# Altium schematic sheet BMS_PowerRegulation.SchDoc
size 431 x 279 mm; SheetNumber: 3; SheetTotal: 5
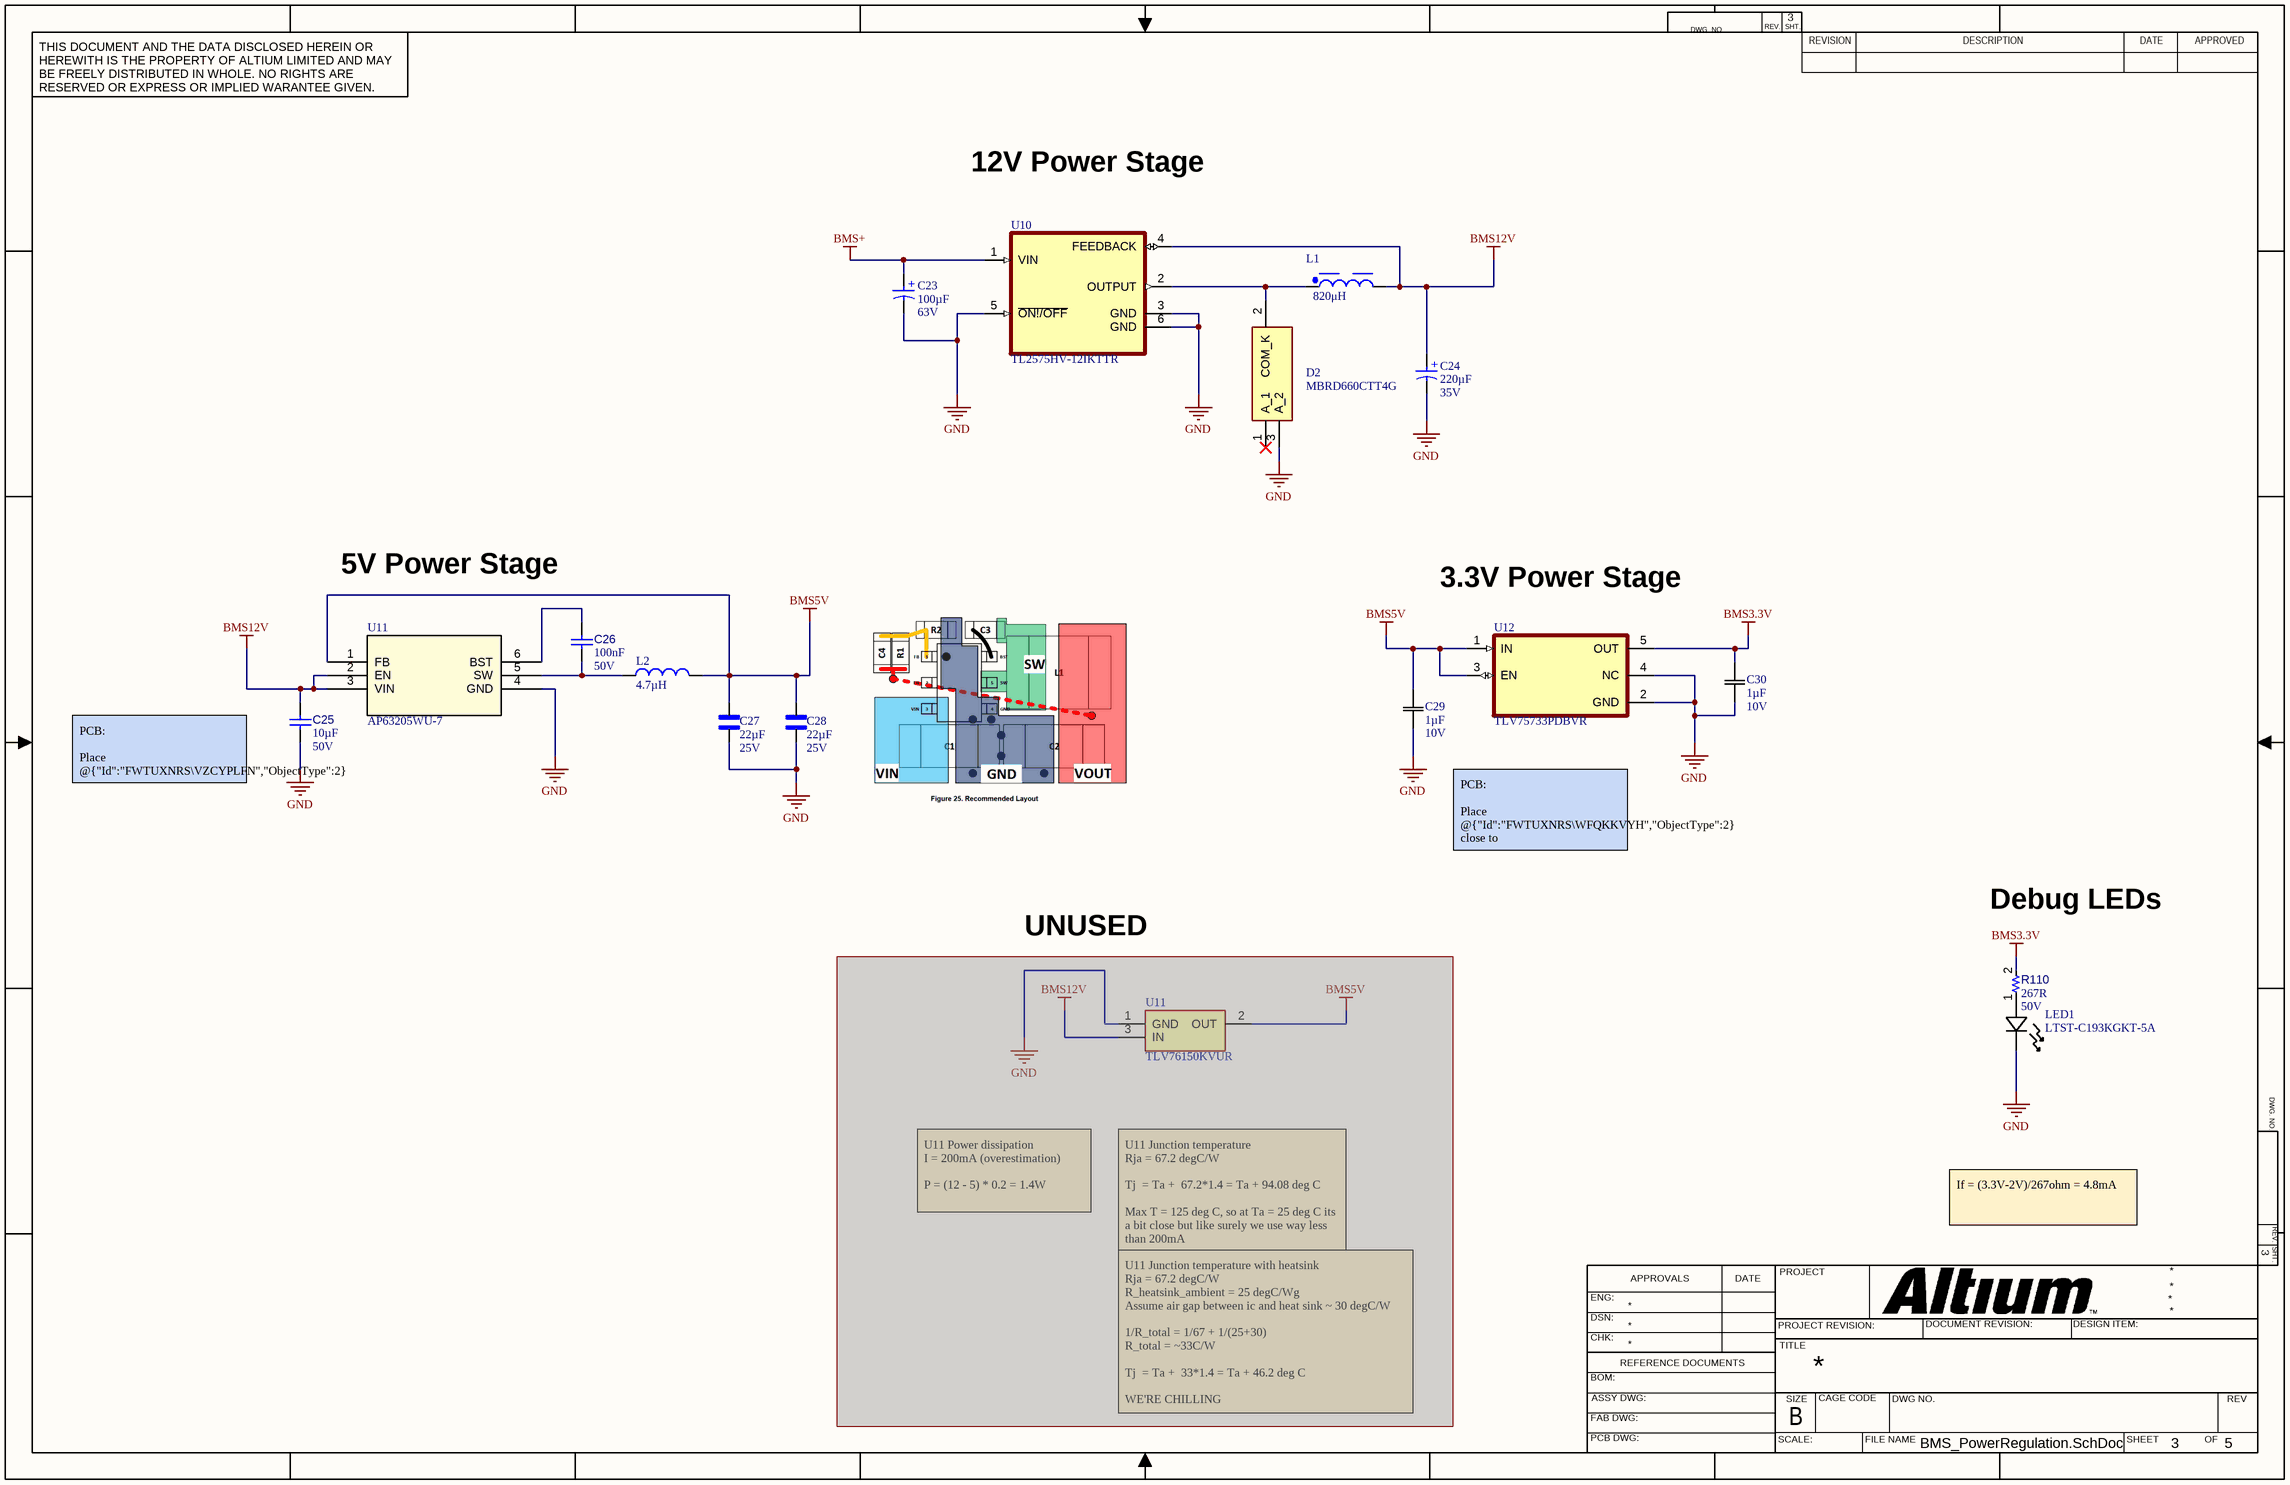
[diagram p0: BMS_PowerRegulation.SchDoc]

## Parts
(Parts that share a designator on the sheet are numbered #1, #2 ... from top to bottom, then left to right.)
C23  value 100µF  Rated Voltage (DC): 63V  [WCAP-ASLI_D10H10.5]  (hidden comment: 865080757014)
C24  value 220µF  Rated Voltage (DC): 35V  [WCAP-ASLI_D8H10.5]  (hidden comment: 865080553014)
C25  value 10µF  Voltage Rating: 50V  [CAPC0805(2012)145_L]  (hidden comment: Samsung Electro-Mechanics CL21A106KBYQNNE)
C26  value 100nF  Voltage Rating: 50V  [CAPC0402(1005)60_L]  (hidden comment: Capacitor 100nF +/-20% 50V 0402)
C27  value 22µF  Voltage Rating: 25V  [CAPC2012X145N]  (hidden comment: CL21A226MAYNNNE)
C28  value 22µF  Voltage Rating: 25V  [CAPC2012X145N]  (hidden comment: CL21A226MAYNNNE)
C29  value 1µF  Voltage Rating: 10V  [CAP_CL10_SAM]  (hidden comment: CL10B105KP8NNNC)
C30  value 1µF  Voltage Rating: 10V  [CAP_CL10_SAM]  (hidden comment: CL10B105KP8NNNC)
D2  MBRD660CTT4G  [MBRD660CTT4G]
L1  Inductance: 820μH  [WE-PD_1210]  (hidden comment: 7447709821 820uH)
L2  value 4.7µH  [INDC2520X100N]  (hidden comment: LQM2HPN4R7MG0L)
LED1  LTST-C193KGKT-5A  [LED_LTST-C194K-0603_1P6X0P8X0P3_LTO]
R110  value 267R  Voltage Rating: 50V  [RESC0402(1005)_L]  (hidden comment: RT0402BRD07267RL)
U10  TL2575HV-12IKTTR  [VREG_TPS79625KTTR]
U11#1  AP63205WU-7  [SOIC_05WU-7_DIO]
U11#2  TLV76150KVUR  [TLV76150KVUR_WithHeatsink]  (masked out: inside a compile mask, not in the netlist)
U12  TLV75733PDBVR  [SOT95P280X145-5N]

## Nets
BMS3.3V: C30.2 R110.2 U12.5(OUT)
BMS5V: C27.2 C28.2 C29.2 L2.2 U11#1.1(FB) U12.1(IN) U12.3(EN)
BMS12V: C24.1(P) C25.1 L1.2 U10.4(FEEDBACK) U11#1.2(EN) U11#1.3(VIN)
BMS+: C23.1(P) U10.1(VIN)
GND: C23.2(N) C24.2(N) C25.2 C27.1 C28.1 C29.1 C30.1 D2.3(A_2) LED1.1 U10.3(GND) U10.5(~{ON!/OFF}) U10.6(GND) U11#1.4(GND) U12.2(GND) U12.4(NC)
NetC26_1: C26.1 L2.1 U11#1.5(SW)
NetC26_2: C26.2 U11#1.6(BST)
NetD2_2: D2.2(COM_K) L1.1 U10.2(OUTPUT)
NetLED1_2: LED1.2 R110.1

Not connected (* = marked no-connect by the designer): D2 1(A_1)*

## Notes on the sheet
- 12V Power Stage
- 5V Power Stage
- 3.3V Power Stage
- PCB:
  Place @{"Id":"FWTUXNRS\VZCYPLFN","ObjectType":2} close to @{"Id":"FWTUXNRS\CUETEAYZ","ObjectType":2} pin 3
- PCB:
  Place @{"Id":"FWTUXNRS\WFQKKVYH","ObjectType":2} close to @{"Id":"FWTUXNRS\HPDKJLBX","ObjectType":2} pin 1
  Place @{"Id":"FWTUXNRS\TOYSBIWG","ObjectType":2} close to @{"Id":"FWTUXNRS\HPDKJLBX","ObjectType":2} pin 5
- UNUSED
- Debug LEDs
- U11 Power dissipation
  I = 200mA (overestimation)
  P = (12 - 5) * 0.2 = 1.4W
- If = (3.3V-2V)/267ohm = 4.8mA
- U11 Junction temperature
  Rja = 67.2 degC/W
  Tj  = Ta +  67.2*1.4 = Ta + 94.08 deg C
  Max T = 125 deg C, so at Ta = 25 deg C its a bit close but like surely we use way less than 200mA
- U11 Junction temperature with heatsink
  Rja = 67.2 degC/W
  R_heatsink_ambient = 25 degC/Wg
  Assume air gap between ic and heat sink ~ 30 degC/W
  1/R_total = 1/67 + 1/(25+30)
  R_total = ~33C/W
  Tj  = Ta +  33*1.4 = Ta + 46.2 deg C
  WE'RE CHILLING
- DWG. NO.
- REV.
- SHT.
- THIS DOCUMENT AND THE DATA DISCLOSED HEREIN OR HEREWITH IS THE PROPERTY OF ALTIUM LIMITED AND MAY BE FREELY DISTRIBUTED IN WHOLE. NO RIGHTS ARE RESERVED OR EXPRESS OR IMPLIED WARANTEE GIVEN.
- REVISION
- DESCRIPTION
- DATE
- APPROVED
- ENG:
- APPROVALS
- PROJECT
- DSN:
- CHK:
- REFERENCE DOCUMENTS
- PROJECT REVISION:
- TITLE
- DOCUMENT REVISION:
- DESIGN ITEM:
- BOM:
- FAB DWG:
- PCB DWG:
- ASSY DWG:
- SCALE:
- SIZE
- B
- CAGE CODE
- FILE NAME
- DWG NO.
- SHEET
- OF
- REV
- (in symbol CMP-001-00090-1) +
- (in symbol CMP-001-00091-1) +

## Library data of the parts
C23 = CMP-001-00091-1: WCAP-ASLI Aluminum Electrolytic Capacitor, V-Chip, D10 x H10.5mm, 100uF, 63V; Manufacturer: Wurth Elektronik; Technical Reference: ASEF105101M063DVCTEB000; Dissipation Factor: 12%; Leakage Current: 63uA; Ripple Current: 280mA; Endurance: 2000h; Capacitance Tolerance: +/-20%; ComponentLink2URL: https://www.we-online.com/redexpert/spec/865080757014?ad; Diameter: 10mm; ComponentLink2Description: Datasheet Link; Source: WCAP-ASLI.SchLib; Match Code: WCAP-ASLI; Manufacturer Part Number: 865080757014; Mount: Surface Mount; ComponentLink1URL: https://www.we-online.com/redexpert/article/865080757014?ad; Operating Temperature Max: 105°C; Design Item ID: 865080757014; Height: 10.5mm; Operating Temperature Min: -55°C; Packaging: Tape and Reel; Category: Aluminum Electrolytic Capacitors; ComponentLink1Description: Website Link
C24 = CMP-001-00090-1: WCAP-ASLI Aluminum Electrolytic Capacitor, V-Chip, D8 x H10.5mm, 220uF, 35V; Manufacturer: Wurth Elektronik; Ripple Current: 570mA; Endurance: 2000h; Dissipation Factor: 14%; Technical Reference: ASEE105221M035DVCTEB000; Capacitance Tolerance: +/-20%; Leakage Current: 77uA; Packaging: Tape and Reel; Category: Aluminum Electrolytic Capacitors; ComponentLink1URL: https://www.we-online.com/redexpert/article/865080553014?ad; Diameter: 8mm; ComponentLink2URL: https://www.we-online.com/redexpert/spec/865080553014?ad; Height: 10.5mm; Source: WCAP-ASLI.SchLib; Operating Temperature Min: -55°C; Operating Temperature Max: 105°C; Design Item ID: 865080553014; ComponentLink2Description: Datasheet Link; Match Code: WCAP-ASLI; Mount: Surface Mount; Manufacturer Part Number: 865080553014; ComponentLink1Description: Website Link
C25 = CMP-001-00079-4: Chip Capacitor, 10µF +/-20%, 25V, 0805, Thickness 1.45 mm; Tolerance: 10%; Max Operating Temperature: 85°C; Case/Package: 0805; Min Operating Temperature: -55°C; Mounting Technology: SMT; Pins: 2
C26 = CMP-001-00067-3: Chip Capacitor, 100nF +/-20%, 50V, 0402, Thickness 0.6 mm; Tolerance: 10%; Min Operating Temperature: -55°C; Pins: 2; Case/Package: 0402; Max Operating Temperature: 85°C; Mounting Technology: SMT
C27 C28 = CMP-001-00092-3: MF: {'manufacturer': u'Samsung Electro-Mechanics'}; Price: None; Availability: Unavailable; Case/Package: None; Design Item ID: CL21A226MAYNNNE; Source: CL21A226MAYNNNE.SchLib; MP: CL21A226MAYNNNE
C29 C30 = CMP-001-00095-3: No Description Available; Manufacturer_Name: Samsung; Manufacturer_Part_Number: CL10B105KP8NNNC; Design Item ID: CL10B105KP8NNNC; Copyright: Copyright (C) 2025 Ultra Librarian. All rights reserved.; Source: CL10B105KP8NNNC.SchLib
D2 = CMP-004-00031-3: Rectifier Diode, Schottky, 1 Phase, 2 Element, 3A, 60V V(RRM), Silicon; Manufacturer_Name: onsemi; Geometry.Height: 2.51mm; Forward Voltage: 650mV; Pins: 2; Manufacturer_Part_Number: MBRD660CTT4G; Source: MBRD660CTT4G.SchLib; RoHS Compliant: Yes; Datasheet Link: https://www.onsemi.com/pub/Collateral/MBRD620CT-D.PDF; Forward Current: 3A; Case/Package: DPAK3 6.10x6.54x2.28, 2.29P; Peak Inverse Voltage: 60V; Min Operating Temperature: -65°C; Mouser Price/Stock: https://www.mouser.co.uk/ProductDetail/onsemi/MBRD660CTT4G?qs=3JMERSakebo2QxKE182ubQ%3D%3D; Max Operating Temperature: 175°C; Design Item ID: MBRD660CTT4G
L1 = CMP-006-00021-1: WE-PD SMT Power Inductor, size 1210, 820μH, 0.95A, 1000mΩ; Manufacturer: Wurth Elektronik; Saturation Current: 1.1A; DC Resistance: 815mΩ; Self Resonant Frequency: 1.2MHz; Type: Standard; Min Operating Temperature: -40°C; Case/Package: 1210; Length: 12mm; ComponentLink2URL: https://www.we-online.com/redexpert/spec/7447709821?ad; Match Code: WE-PD; Max Operating Temperature: 125°C; Design Item ID: 7447709821; ComponentLink2Description: Datasheet Link; Mount: Surface Mount; ComponentLink1URL: https://www.we-online.com/redexpert/article/7447709821?ad; DC Resistance Max: 1000mΩ; Source: WE-PD.SchLib; Rated Current: 0.95A; Manufacturer Part Number: 7447709821; Width: 12mm; Packaging: Tape and Reel; Height: 10mm; ComponentLink1Description: Website Link; Category: Power Inductors
L2 = CMP-006-00023-3: Inductor with Inductance: 4.7uH Tol. +/-20%, Package: 1008 _2520_; MF: Murata Electronics; Source: SnapEDAsch.SchLib; Availability: Unavailable; SnapEDA_Link: https://www.snapeda.com/parts/LQM2HPN4R7MG0L/Murata%20Electronics%20North%20America/view-part/210541/?ref=snap; Design Item ID: LQM2HPN4R7MG0L; Case/Package: 2520 Murata; Price: None; MP: LQM2HPN4R7MG0L
LED1 = CMP-007-00036-3: No Description Available; Manufacturer_Name: LITE-ON; Type: LED Indication; Source: LTST-C194KGKT.SchLib; Manufacturer_Part_Number: LTST-C194KGKT; Design Item ID: LTST-C194KGKT; Copyright: Copyright (C) 2025 Ultra Librarian. All rights reserved.
R110 = CMP-009-00065-4: 100R 0.063W 1% 0402 (1005 Metric)  SMD; Power: 63mW; Mounting Technology: SMT; Case/Package: 0402; Pins: 2; Tolerance: 1%
U10 = CMP-063-000000-4: Switching Regulator, Voltage-mode, 4A, 58kHz Switching Freq-Max, PSSO5; Max Supply Voltage: 60V; Output Current: 1A; Frequency: 52kHz; Feedback Bias Current: 500nA; Min Supply Voltage: 4.75V; Output Voltage: 12V; Max frequency: 63kHz; Design Item ID: TL2575HV-12IKTTR; Case/Package: TO-263; Source: TL2575HV-12IKTTR.SchLib; MP: TL2575HV-12IKTTR; Pins: 5; Price: None; Pin Count: 6; Value: *; Component Type: Standard; Package: None; Max Operating Temperature: 125°C; RoHS Compliant: Yes; Min Operating Temperature: -40°C
U11#1 = CMP-075-000000-2: No Description Available; Manufacturer_Name: Diodes Inc; Manufacturer_Part_Number: AP63205WU-7; Type: Type; Source: AP63205WU-7.SchLib; RefDes: RefDes; Copyright: Copyright (C) 2025 Ultra Librarian. All rights reserved.; Design Item ID: AP63205WU-7
U11#2 = CMP-031-00010-2: Linear Voltage Regulator IC Positive Fixed 1 Output 1A TO-252, 1.6V @ 1A, 100 A, 60dB ~ 40dB , -40C ~ 125C (TJ); Manufacturer_Part_Number: TLV76133KVUR; Manufacturer_Name: Texas Instruments; Geometry.Height: 2.65mm; Output Voltage: 5V; Min Supply Voltage: 2.5V; Max Supply Voltage: 18V; Min Operating Temperature: -40°C; Max Operating Temperature: 125°C; Output Current: 1A; Mouser Part Number: 595-TLV76150KVUR; Source: TLV76150KVUR.SchLib; Design Item ID: TLV76150KVUR
U12 = CMP-089-000000-2: 1-A, low-IQ high-accuracy low-dropout (LDO) voltage regulator with enable; MF: Texas Instruments; SnapEDA_Link: https://www.snapeda.com/parts/TLV75733PDBVR/Texas+Instruments/view-part/?ref=snap; Source: TLV75733PDBVR.SchLib; Package: SOT-23-5 Texas Instruments; Pin Count: 4; Design Item ID: TLV75733PDBVR; Check_prices: https://www.snapeda.com/parts/TLV75733PDBVR/Texas+Instruments/view-part/?ref=eda; Value: *; MP: TLV75733PDBVR; Component Type: Standard